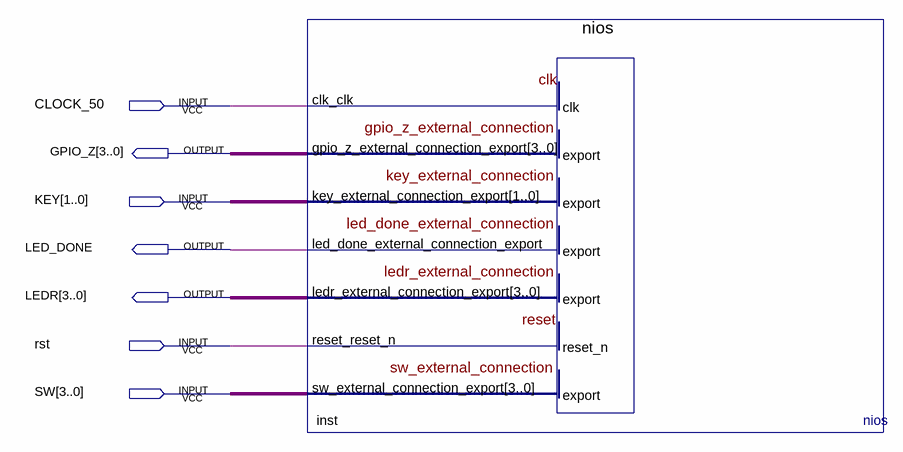
[diagram p0: schematic sheet]
// Quartus schematic FPGA1.bdf as structural Verilog: 1 symbols, 7 pins
module FPGA1 (
  input  CLOCK_50,
  input  [1:0] KEY,
  input  rst,
  input  [3:0] SW,
  output [3:0] GPIO_Z,
  output LED_DONE,
  output [3:0] LEDR
);

  nios inst (
    .clk_clk(CLOCK_50), .key_external_connection_export(KEY), .reset_reset_n(rst),
    .sw_external_connection_export(SW), .gpio_z_external_connection_export(GPIO_Z),
    .led_done_external_connection_export(LED_DONE), .ledr_external_connection_export(LEDR));
endmodule
